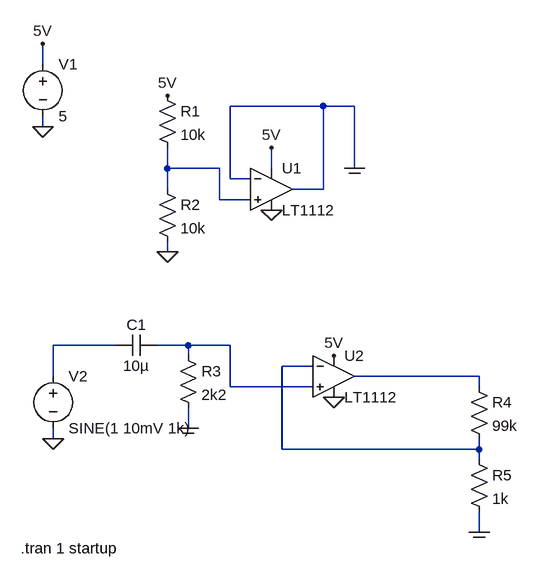
[diagram p0: schematic Mikver1.asc]
Mikver1.asc, the LTspice schematic file:
Version 4
SHEET 1 880 728
WIRE -112 -32 -112 -64
WIRE 320 32 176 32
WIRE 368 32 320 32
WIRE -112 64 -112 48
WIRE 80 128 80 96
WIRE 160 128 80 128
WIRE 240 128 240 96
WIRE 368 128 368 32
WIRE 176 144 176 32
WIRE 208 144 176 144
WIRE 80 160 80 128
WIRE 320 160 320 32
WIRE 320 160 272 160
WIRE 160 176 160 128
WIRE 208 176 160 176
WIRE 80 256 80 240
WIRE 0 400 -96 400
WIRE 112 400 64 400
WIRE 176 400 112 400
WIRE 112 416 112 400
WIRE 304 432 256 432
WIRE -96 448 -96 400
WIRE 560 448 368 448
WIRE 176 464 176 400
WIRE 304 464 176 464
WIRE 560 464 560 448
WIRE 112 528 112 496
WIRE -96 544 -96 528
WIRE 256 560 256 432
WIRE 560 560 560 544
WIRE 560 560 256 560
WIRE 560 576 560 560
WIRE 560 688 560 656
FLAG -112 64 0
FLAG -112 -64 5V
FLAG 240 96 5V
FLAG 80 16 5V
FLAG 336 416 5V
FLAG 80 256 0
FLAG 240 192 0
FLAG 336 480 0
FLAG 368 128 COM
FLAG 112 528 COM
FLAG -96 544 0
FLAG 560 688 COM
SYMBOL voltage -112 -48 R0
WINDOW 123 0 0 Left 2
WINDOW 39 0 0 Left 2
SYMATTR InstName V1
SYMATTR Value 5
SYMBOL Opamps\\LT1112 240 96 R0
SYMATTR InstName U1
SYMBOL Opamps\\LT1112 336 384 R0
SYMATTR InstName U2
SYMBOL res 64 0 R0
SYMATTR InstName R1
SYMATTR Value 10k
SYMBOL res 64 144 R0
SYMATTR InstName R2
SYMATTR Value 10k
SYMBOL voltage -96 432 R0
WINDOW 123 0 0 Left 2
WINDOW 39 0 0 Left 2
SYMATTR InstName V2
SYMATTR Value SINE(1 10mV 1k)
SYMBOL cap 64 384 R90
WINDOW 0 0 32 VBottom 2
WINDOW 3 32 32 VTop 2
SYMATTR InstName C1
SYMATTR Value 10µ
SYMBOL res 96 400 R0
SYMATTR InstName R3
SYMATTR Value 2k2
SYMBOL res 544 448 R0
SYMATTR InstName R4
SYMATTR Value 99k
SYMBOL res 544 560 R0
SYMATTR InstName R5
SYMATTR Value 1k
TEXT -146 712 Left 2 !.tran 1 startup

The netlist it stands for:
* Mikver1.asc
V1 5V 0 5
XU1 N001 COM 5V 0 COM LT1112  ; pins In+ In- V+ V- OUT
XU2 N003 N004 5V 0 N005 LT1112  ; pins In+ In- V+ V- OUT
R1 5V N001 10k
R2 N001 0 10k
V2 N002 0 SINE(1 10mV 1k)
C1 N003 N002 10µ
R3 N003 COM 2k2
R4 N005 N004 99k
R5 N004 COM 1k
.tran 1 startup
.lib LTC.lib
.backanno
.end